# Altium schematic sheet sch_camera.SchDoc
size A4
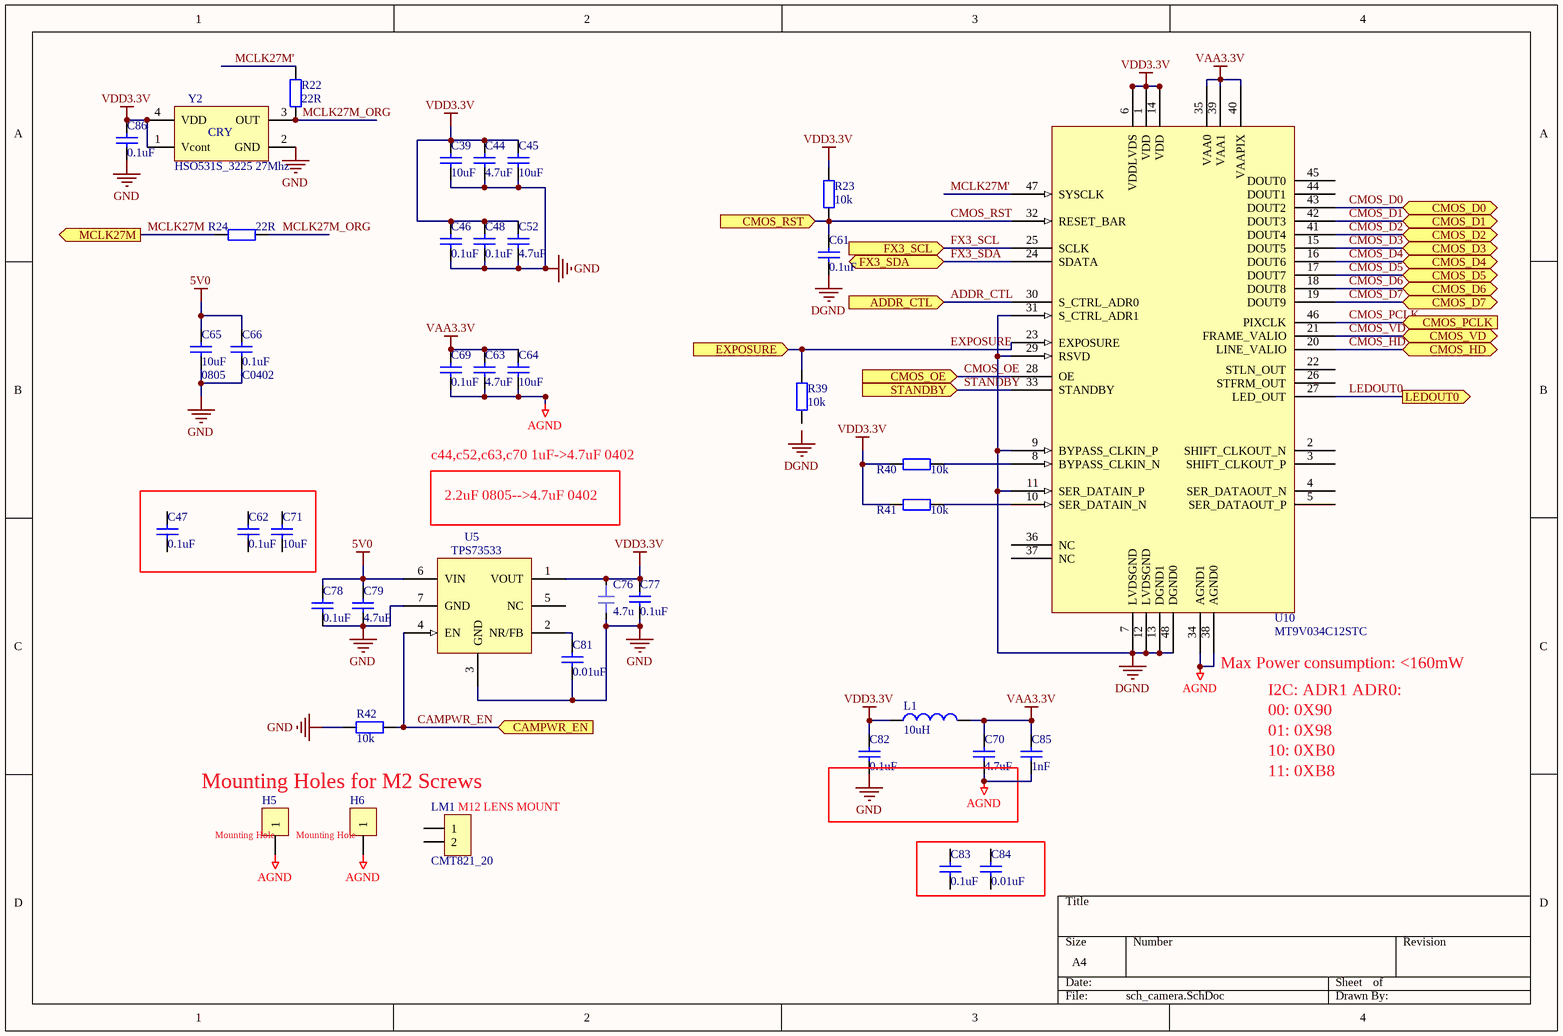
[diagram p0: sch_camera.SchDoc]

## Parts
C39  10uF  [0805C]
C44  4.7uF  [0402C]
C45  10uF  [0805C]
C46  0.1uF  [0402C]
C47  0.1uF  [0402C]
C48  0.1uF  [0402C]
C52  4.7uF  [0402C]
C61  0.1uF  [0402C]
C62  0.1uF  [0402C]
C63  4.7uF  [0402C]
C64  10uF  [0805C]
C65  10uF  value 0805  [0805C]
C66  0.1uF  value C0402  [0402C]
C69  0.1uF  [0402C]
C70  4.7uF  [0402C]
C71  10uF  [0805C]
C76  4.7u  [0402C_L]
C77  0.1uF  [0402C_L]
C78  0.1uF  [0402C]
C79  value 4.7uF  [0402C_L]  (hidden comment: 1uF)
C81  0.01uF  [0402C_L]
C82  0.1uF  [0402C_L]
C83  0.1uF  [0402C_L]
C84  0.01uF  [0402C_L]
C85  1nF  [0402C_L]
C86  0.1uF  [0402C_L]
H5  CON1  [PAD_M3_D350_450]  (value not drawn)
H6  CON1  [PAD_M3_D350_450]  (value not drawn)
L1  10uH  [0805R]
LM1  CMT821_20  [PAD_M3_D350_450]
R22  value 22R  [0402R_L]  (hidden comment: 0R)
R23  10K  [0402R]
R24  22R  [0402R]
R39  10K  [0402R]
R40  10K  [0402R]
R41  10K  [0402R]
R42  10K  [0402R_L]
U5  TPS73533  [SON6_P65L21W21H8_DRV]
U10  MT9V034C12STC  [CLCC48_P80L114W114H23]
Y2  HSO531S_3225 27Mhz  [XTAL_3225]

## Ports
ADDR_CTL (in), CAMPWR_EN (in), CMOS_D0 (bidir), CMOS_D1 (bidir), CMOS_D2 (bidir), CMOS_D3 (bidir), CMOS_D4 (bidir), CMOS_D5 (bidir), CMOS_D6 (bidir), CMOS_D7 (bidir), CMOS_HD (bidir), CMOS_OE (in), CMOS_PCLK (in), CMOS_RST (in), CMOS_VD (bidir), EXPOSURE (in), FX3_SCL (in), FX3_SDA (bidir), LEDOUT0 (out), MCLK27M (out), STANDBY (in)

## Nets
5V0: C65.2 C66.2 C78.2 C79.2 U5.6(VIN)
AGND: C63.1 C64.1 C69.1 C70.1 C85.1 H5.1 H6.1 U10.34(AGND1) U10.38(AGND0)
DGND: C61.1 U10.7(LVDSGND) U10.9(BYPASS_CLKIN_P) U10.11(SER_DATAIN_P) U10.12(LVDSGND) U10.13(DGND1) U10.29(RSVD) U10.31(S_CTRL_ADR1) U10.48(DGND0)
GND: C39.1 C44.1 C45.1 C46.1 C48.1 C52.1 C65.1 C66.1 C76.2 C77.1 C78.1 C79.1 C81.1 C82.1 C86.1 R42.2 U5.3(GND) U5.7(GND) Y2.2(GND)
VAA3.3V: C63.2 C64.2 C69.2 C70.2 C85.2 L1.2 U10.35(VAA0) U10.39(VAA1) U10.40(VAAPIX)
VDD3.3V: C39.2 C44.2 C45.2 C46.2 C48.2 C52.2 C76.1 C77.2 C82.2 C86.2 L1.1 R23.2 R40.2 R41.2 U5.1(VOUT) U10.1(VDD) U10.6(VDDLVDS) U10.14(VDD) Y2.1(Vcont) Y2.4(VDD)
ADDR_CTL: U10.30(S_CTRL_ADR0) ; port ADDR_CTL
CAMPWR_EN: R42.1 U5.4(EN) ; port CAMPWR_EN
CMOS_D0: U10.43(DOUT2) ; port CMOS_D0
CMOS_D1: U10.42(DOUT3) ; port CMOS_D1
CMOS_D2: U10.41(DOUT4) ; port CMOS_D2
CMOS_D3: U10.15(DOUT5) ; port CMOS_D3
CMOS_D4: U10.16(DOUT6) ; port CMOS_D4
CMOS_D5: U10.17(DOUT7) ; port CMOS_D5
CMOS_D6: U10.18(DOUT8) ; port CMOS_D6
CMOS_D7: U10.19(DOUT9) ; port CMOS_D7
CMOS_HD: U10.20(LINE_VALIO) ; port CMOS_HD
CMOS_OE: U10.28(OE) ; port CMOS_OE
CMOS_PCLK: U10.46(PIXCLK) ; port CMOS_PCLK
CMOS_RST: C61.2 R23.1 U10.32(RESET_BAR) ; port CMOS_RST
CMOS_VD: U10.21(FRAME_VALIO) ; port CMOS_VD
EXPOSURE: R39.1 U10.23(EXPOSURE) ; port EXPOSURE
FX3_SCL: U10.25(SCLK) ; port FX3_SCL
FX3_SDA: U10.24(SDATA) ; port FX3_SDA
LEDOUT0: U10.27(LED_OUT) ; port LEDOUT0
MCLK27M: R24.1 ; port MCLK27M
MCLK27M': R22.1 U10.47(SYSCLK)
MCLK27M_ORG: R22.2 R24.2 Y2.3(OUT)
STANDBY: U10.33(STANDBY) ; port STANDBY
NetC81_2: C81.2 U5.2(NR/FB)
NetR40_1: R40.1 U10.8(BYPASS_CLKIN_N)
NetR41_1: R41.1 U10.10(SER_DATAIN_N)

Not connected (* = marked no-connect by the designer): C47 1 2; C62 1 2; C71 1 2; C83 1 2; C84 1 2; LM1 1 2; R39 2; U5 5(NC); U10 2(SHIFT_CLKOUT_N) 3(SHIFT_CLKOUT_P) 4(SER_DATAOUT_N) 5(SER_DATAOUT_P) 22(STLN_OUT) 26(STFRM_OUT) 36(NC) 37(NC) 44(DOUT1) 45(DOUT0)

## Notes on the sheet
- c44,c52,c63,c70 1uF->4.7uF 0402
- 2.2uF 0805-->4.7uF 0402
- (near U10) Max Power consumption: <160mW
- I2C: ADR1 ADR0:
- 00: 0X90
- Mounting Holes for M2 Screws
- 01: 0X98
- 10: 0XB0
- 11: 0XB8
- (near H5) Mounting Hole
- (near H6) Mounting Hole
- (near LM1) M12 LENS MOUNT
- Labels drawn without touching a wire or pin: DGND

## Library data of the parts
C39 C44-C48 C52 C61-C66 C69-C71 C77-C79 C81-C86 = Cap: Capacitor; Published: 8-Jun-2000; LatestRevisionDate: 17-Jul-2002; LatestRevisionNote: Re-released for DXP Platform.; Publisher: Altium Limited
  C39 C45 C64 C71: PackageReference: RAD-0.3; Value: 10uF
  C44 C52 C63 C70: PackageReference: RAD-0.3; Value: 4.7uF
  C46-C48 C61 C62 C69 C77 C78 C82 C83 C86: Value: 0.1uF
  C65 C79: PackageReference: RAD-0.3
  C81: PackageReference: RAD-0.3; Value: 0.01uF
  C84: Value: 0.01uF
  C85: Value: 1nF
C76 = cap0402: CC0402MRX5R5BB475; 元件类别: 贴片电容; 主物料厂家: YAGEO
H5 H6 = CON1: Connector
L1 = Inductor: Value: 330mH
LM1 = CON2: Connector
R22-R24 R39-R42 = Resistor: Published: 8-Jun-2000; LatestRevisionDate: 17-Jul-2002; LatestRevisionNote: Re-released for DXP Platform.; PackageReference: AXIAL-0.4; Publisher: Altium Limited
  R23 R39-R42: Value: 10k
  R24: Value: 22R
U10 = MT9V034
Y2 = CRY: 有源晶振